# EAGLE design SmartServoModule_1_0 (EAGLE 9.6.2)
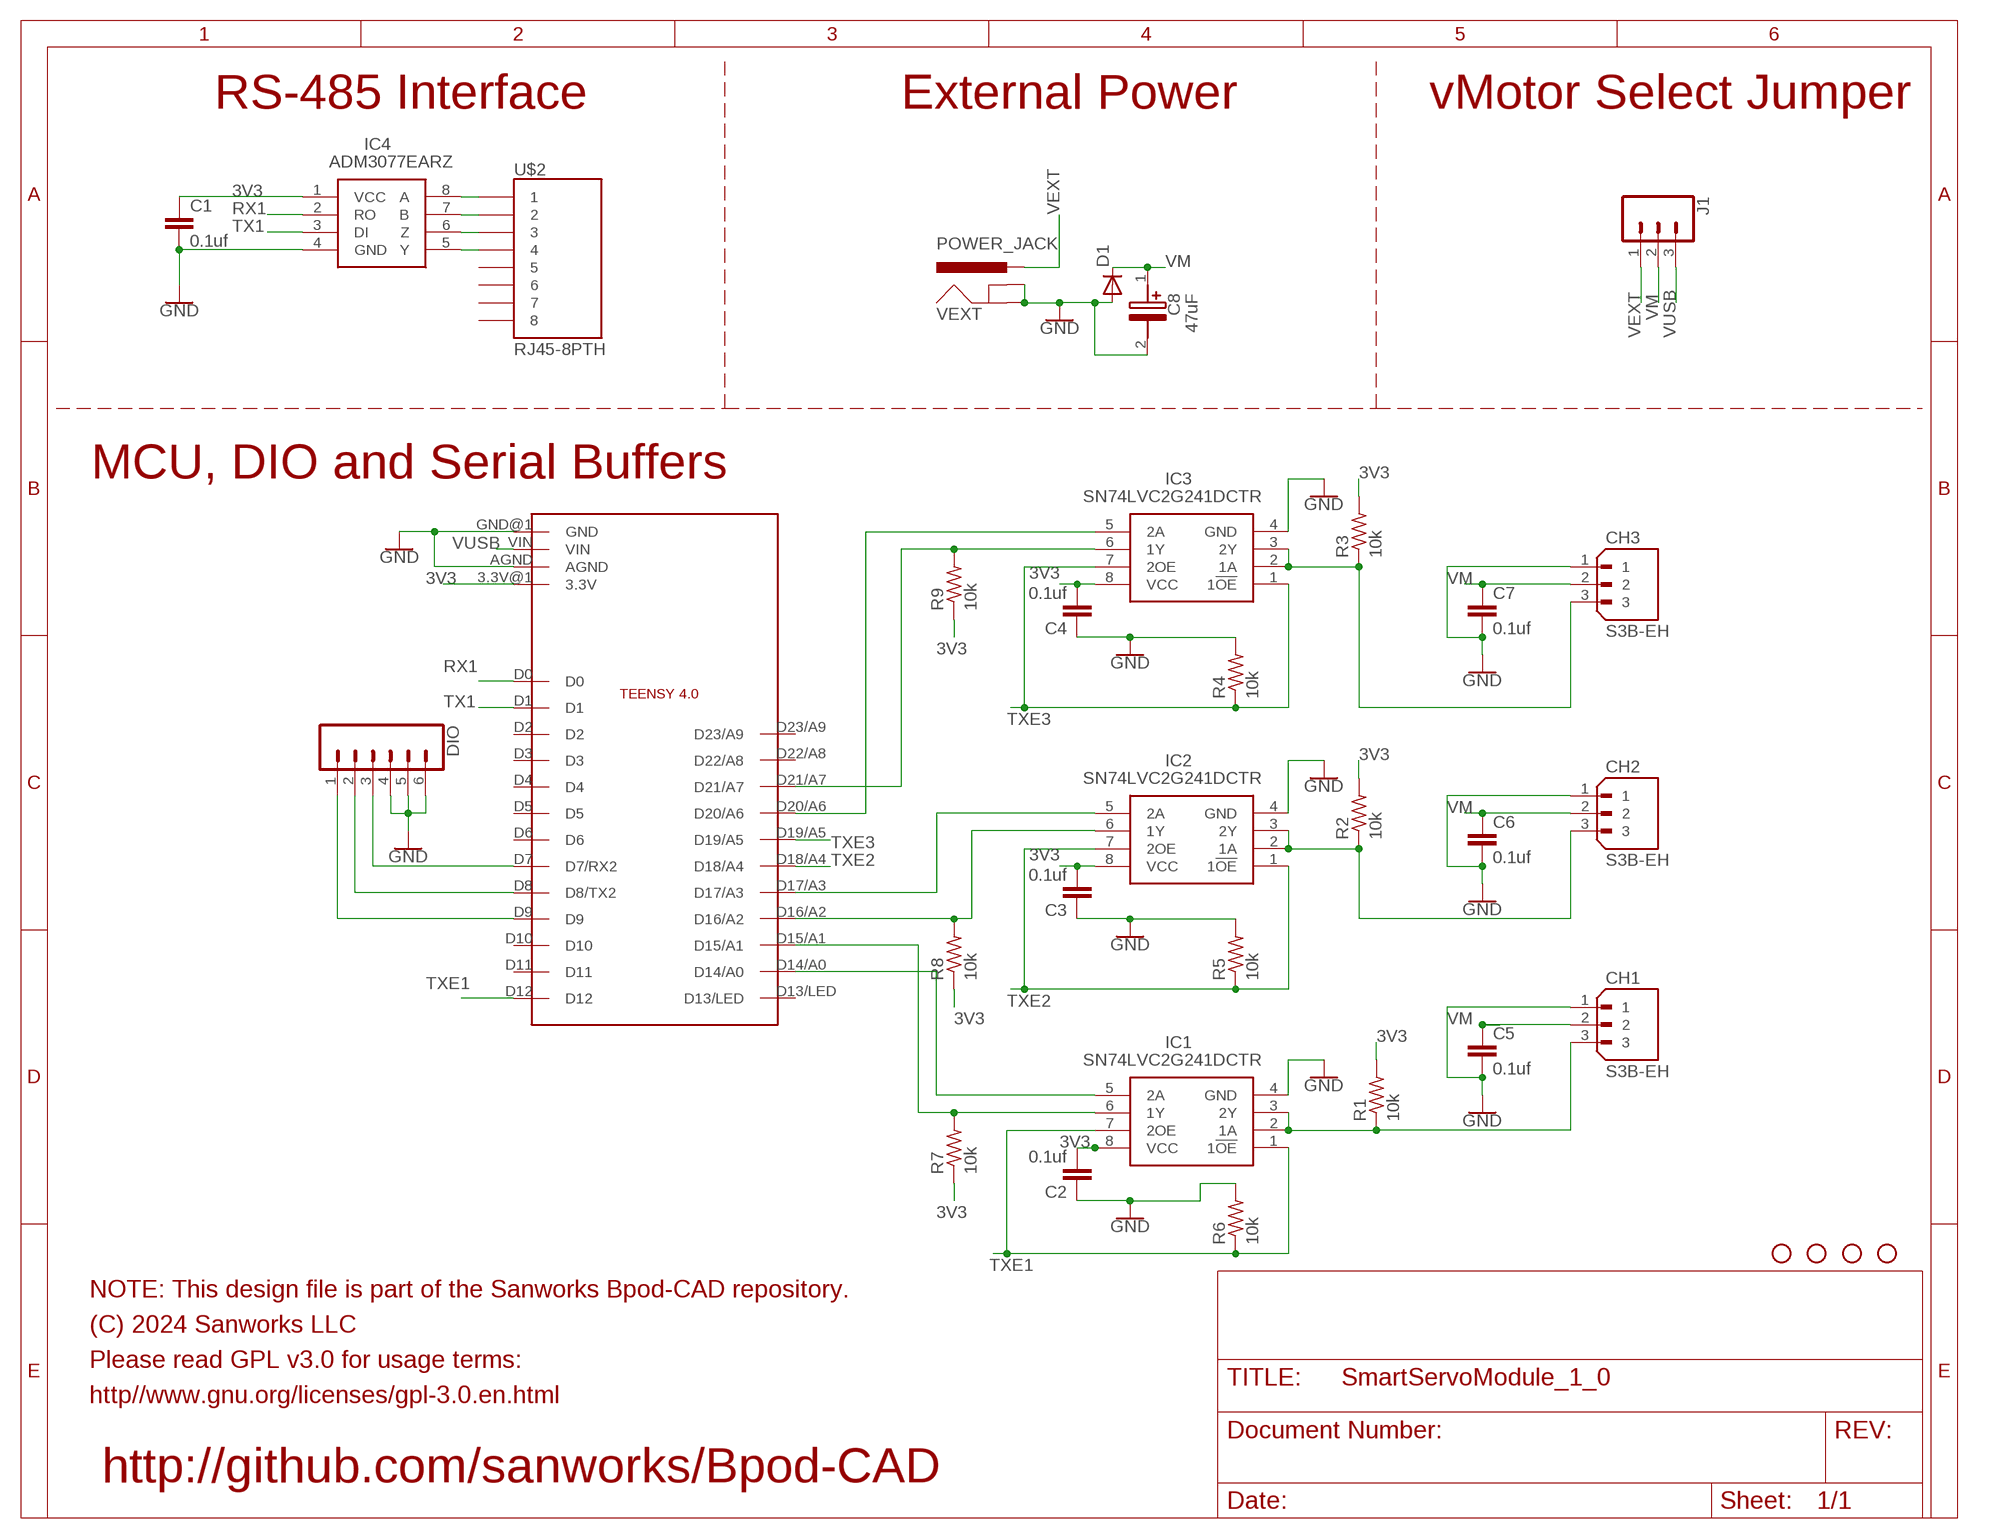
[diagram p0: schematic, sheet 1]

## Parts
C1  0.1uf  10UF-0805-10V-10%  [0805]
C2  0.1uf  10UF-0805-10V-10%  [0805]
C3  0.1uf  10UF-0805-10V-10%  [0805]
C4  0.1uf  10UF-0805-10V-10%  [0805]
C5  0.1uf  10UF-0805-10V-10%  [0805]
C6  0.1uf  10UF-0805-10V-10%  [0805]
C7  0.1uf  10UF-0805-10V-10%  [0805]
C8  47uF  EEH-ZA1V470P  [EEHZA1E101XP]
CH1  S3B-EH  [JST_S3B-EH]
CH2  S3B-EH  [JST_S3B-EH]
CH3  S3B-EH  [JST_S3B-EH]
D1  DIODE-DO214AA  [DO214AA]
DIO  CONN_063.5MM-6  [SCREWTERMINAL-3.5MM-6]
H1  STAND-OFF  [STAND-OFF]
H2  STAND-OFF  [STAND-OFF]
H3  STAND-OFF  [STAND-OFF]
H4  STAND-OFF  [STAND-OFF]
IC1  SN74LVC2G241DCTR  [SOP65P400X130-8N]
IC2  SN74LVC2G241DCTR  [SOP65P400X130-8N]
IC3  SN74LVC2G241DCTR  [SOP65P400X130-8N]
IC4  ADM3077EARZ  [SOIC127P600X175-8N]
J1  CONN_03LOCK  [1X03_LOCK]
MC1  TEENSY4.0_SIMPLE_NO_VUSB  [TEENSY4.0_SIMPLE_NO_VUSB]
R1  10k  R-US_R0805  [R0805]
R2  10k  R-US_R0805  [R0805]
R3  10k  R-US_R0805  [R0805]
R4  10k  R-US_R0805  [R0805]
R5  10k  R-US_R0805  [R0805]
R6  10k  R-US_R0805  [R0805]
R7  10k  R-US_R0805  [R0805]
R8  10k  R-US_R0805  [R0805]
R9  10k  R-US_R0805  [R0805]
U$2  RJ45-8PTH  [RJ45-8]
VEXT  POWER_JACK  [POWER_JACK_PTH]

## Nets
3V3: C1.1 C2.2 C3.2 C4.2 IC1.8(VCC) IC2.8(VCC) IC3.8(VCC) IC4.1(VCC) MC1.3.3V@1(3.3V) R1.2 R2.2 R3.2 R7.1 R8.1 R9.1
GND: C1.2 C2.1 C3.1 C4.1 C5.2 C6.2 C7.2 C8.2(-) CH1.1 CH2.1 CH3.1 D1.A DIO.4 DIO.5 DIO.6 IC1.4(GND) IC2.4(GND) IC3.4(GND) IC4.4(GND) MC1.AGND MC1.GND@1(GND) R4.2 R5.2 R6.2 VEXT.GND VEXT.GNDBREAK
N$1: IC4.6(Z) U$2.3
N$2: CH1.3 IC1.2(1A) IC1.3(2Y) R1.1
N$3: IC4.8(A) U$2.1
N$4: IC4.5(Y) U$2.4
N$5: IC4.7(B) U$2.2
N$6: CH2.3 IC2.2(1A) IC2.3(2Y) R2.1
N$7: CH3.3 IC3.2(1A) IC3.3(2Y) R3.1
N$8: DIO.1 MC1.D9
N$9: DIO.2 MC1.D8(D8/TX2)
N$10: DIO.3 MC1.D7(D7/RX2)
N$11: IC1.5(2A) MC1.D14/A0
N$12: IC1.6(1Y) MC1.D15/A1 R7.2
N$13: IC2.5(2A) MC1.D17/A3
N$14: IC2.6(1Y) MC1.D16/A2 R8.2
N$15: IC3.5(2A) MC1.D20/A6
N$16: IC3.6(1Y) MC1.D21/A7 R9.2
RX1: IC4.2(RO) MC1.D0
TX1: IC4.3(DI) MC1.D1
TXE1: IC1.1(1!OE) IC1.7(2OE) MC1.D12 R6.1
TXE2: IC2.1(1!OE) IC2.7(2OE) MC1.D18/A4 R5.1
TXE3: IC3.1(1!OE) IC3.7(2OE) MC1.D19/A5 R4.1
VEXT: J1.1 VEXT.PWR
VM: C5.1 C6.1 C7.1 C8.1(+) CH1.2 CH2.2 CH3.2 D1.C J1.2
VUSB: J1.3 MC1.VIN
Unconnected: MC1.D2 MC1.D3 MC1.D4 MC1.D5 MC1.D6 MC1.D10 MC1.D11 MC1.D13/LED MC1.D22/A8 MC1.D23/A9 U$2.5 U$2.6 U$2.7 U$2.8

## Notes on the sheet
- RS-485 Interface | External Power | vMotor Select Jumper
- MCU, DIO and Serial Buffers
- NOTE: This design file is part of the Sanworks Bpod-CAD repository.
- (C) 2024 Sanworks LLC
- Please read GPL v3.0 for usage terms:
- http//www.gnu.org/licenses/gpl-3.0.en.html
- http://github.com/sanworks/Bpod-CAD

## Library data of the parts
C1-C7 = SparkFun-Capacitors:10UF: 10.0µF ceramic capacitors A capacitor is a passive two-terminal electrical component used to store electrical energy temporarily in an electric field.; PROD_ID: CAP-11330; VALUE: 10uF
C8 = EEH-ZA1V470P:EEH-ZA1V470P: Aluminum Organic Polymer Capacitors 47uF 35volt AEC-Q200 Source: Datasheet <http://industrial.panasonic.com/cdbs/www-data/pdf/RDD0000/ABA0000C1221.pdf>; DESCRIPTION: Aluminum Organic Polymer Capacitors 47uF 35volt AEC-Q200; HEIGHT: 8.3mm; MANUFACTURER_NAME: Panasonic; MANUFACTURER_PART_NUMBER: EEH-ZA1V470P; MOUSER_PART_NUMBER: 667-EEH-ZA1V470P; MOUSER_PRICE-STOCK: https://www.mouser.co.uk/ProductDetail/Panasonic/EEH-ZA1V470P?qs=7UCyOFMWVHbDVjI675WvgQ%3D%3D
CH1-CH3 = S3B-EH:S3B-EH; MANUFACTURER: JST Sales; MAXIMUM_PACKAGE_HEIGHT: 4.2mm; PARTREV: 16/3/22; STANDARD: Manufacturer Recommendations
D1 = diode:DIODE-: DIODE
DIO = SparkFun-Connectors:CONN_06: Multi connection point. Often used as Generic Header-pin footprint for 0.1 inch spaced/style header connections On any of the 0.1 inch spaced packages, you can populate with these: Break Away Headers - Straight <https://www.sparkfun.com/products/116> (PRT-00116) Break Away Male Headers - Right Angle <https://www.sparkfun.com/products/553> (PRT-00553) Female Headers <https://www.sparkfun.com/products/115> (PRT-00115) Break Away Headers - Machine Pin <https://www.sparkfun.com/products/117> (PRT-00117) Break Away Female Headers - Swiss Machine Pin <https://www.sparkfun.com/products/743> (PRT-00743) Arduino Stackable Header - 6 Pin <https://www.sparkfun.com/products/9280> (PRT-09280) For SCREWTERMINALS and SPRING TERMINALS visit here: Screw Terimnals on SparkFun.com <https://www.sparkfun.com/search/results?term=Screw+Terminals> (5mm/3.5mm/2.54mm spacing) This device is also useful as a general connection point to wire up your design to another part of your project. Our various solder wires solder well into these plated through hole pads. Hook-Up Wire - Assortment (Stranded, 22 AWG) <https://www.sparkfun.com/products/11375> (PRT-11375) Hook-Up Wire - Assortment (Solid Core, 22 AWG) <https://www.sparkfun.com/products/11367> (PRT-11367) View the entire wire category on our website here <https://www.sparkfun.com/categories/141>
H1-H4 = SparkFun-Hardware:STAND-OFF: Stand Off Drill holes for mechanically mounting via screws, standoffs, etc. Note: Use the keepout ring to avoid running the screw head into surrounding components. Variant Overviews STAND-OFF - Mechanical footprint for a #4 phillips button head screw. STAND-OFF-TIGHT - Mechanical footprint for a #4 phillips button head screw, Example SparkFun Products Screw - Phillips Head (1/4", 4-40, 10 pack) <https://www.sparkfun.com/products/10453> (PRT-10453) Screw - Phillips Head (1/2", 4-40, 10 pack) <https://www.sparkfun.com/products/10452> (PRT-10452) Screw - Phillips Head (3/4", 4-40, 10 pack) <https://www.sparkfun.com/products/10451> (PRT-10451) Screw - Phillips Head (1", 4-40, 10 pack) <https://www.sparkfun.com/products/10450> (PRT-10450)
IC1-IC3 = SN74LVC2G241DCTR:SN74LVC2G241DCTR: Dual Buffer/Driver With 3-State Outputs Source: Datasheet <http://www.ti.com/lit/gpn/sn74lvc2g241>; DESCRIPTION: Dual Buffer/Driver With 3-State Outputs; HEIGHT: 1.3mm; MANUFACTURER_NAME: Texas Instruments; MANUFACTURER_PART_NUMBER: SN74LVC2G241DCTR; MOUSER_PART_NUMBER: 595-SN74LVC2G241DCTR; MOUSER_PRICE-STOCK: https://www.mouser.co.uk/ProductDetail/Texas-Instruments/SN74LVC2G241DCTR?qs=FetendrIl6uh8lISnOsUbw%3D%3D
IC4 = ADM3077EARZ:ADM3077EARZ: ADM3077EARZ, Line Transceiver 16Mbit/s Differential, 3.3 V, 8-Pin SOIC Source: Datasheet <http://www.analog.com/static/imported-files/data_sheets/ADM3070E_3071E_3072E_3073E_3074E_3075E_3076E_3077E_3078E.pdf>; DESCRIPTION: ADM3077EARZ, Line Transceiver 16Mbit/s Differential, 3.3 V, 8-Pin SOIC; HEIGHT: 1.75mm; MANUFACTURER_NAME: Analog Devices; MANUFACTURER_PART_NUMBER: ADM3077EARZ; MOUSER_PART_NUMBER: 584-ADM3077EARZ; MOUSER_PRICE-STOCK: https://www.mouser.co.uk/ProductDetail/Analog-Devices/ADM3077EARZ?qs=BpaRKvA4VqHlrE32Vsw1mw%3D%3D
J1 = SparkFun-Connectors:CONN_03: Multi connection point. Often used as Generic Header-pin footprint for 0.1 inch spaced/style header connections On any of the 0.1 inch spaced packages, you can populate with these: Break Away Headers - Straight <https://www.sparkfun.com/products/116> (PRT-00116) Break Away Male Headers - Right Angle <https://www.sparkfun.com/products/553> (PRT-00553) Female Headers <https://www.sparkfun.com/products/115> (PRT-00115) Break Away Headers - Machine Pin <https://www.sparkfun.com/products/117> (PRT-00117) Break Away Female Headers - Swiss Machine Pin <https://www.sparkfun.com/products/743> (PRT-00743) Stackable Header - 3 Pin (Female, 0.1") <https://www.sparkfun.com/products/13875> (PRT-13875) For SCREWTERMINALS and SPRING TERMINALS visit here: Screw Terimnals on SparkFun.com <https://www.sparkfun.com/search/results?term=Screw+Terminals> (5mm/3.5mm/2.54mm spacing) This device is also useful as a general connection point to wire up your design to another part of your project. Our various solder wires solder well into these plated through hole pads. Hook-Up Wire - Assortment (Stranded, 22 AWG) <https://www.sparkfun.com/products/11375> (PRT-11375) Hook-Up Wire - Assortment (Solid Core, 22 AWG) <https://www.sparkfun.com/products/11367> (PRT-11367) View the entire wire category on our website here <https://www.sparkfun.com/categories/141> Special notes: Molex polarized connector foot print use with SKU : PRT-08232 with associated crimp pins and housings.
MC1 = Teensy4.0_SIMPLE_N_VUSB:TEENSY4.0_SIMPLE_NO_VUSB: Tennsy 4.0 simple layout (no underside pins or VUSB )
R1-R9 = adafruit:R-US_: RESISTOR, American symbol
U$2 = SparkFun:RJ45-8: RJ45 Jack Simple RJ45, 8-pin connection - connector for common Cat5, Cat5e, and Cat6 Ethernet cables. Footprint not yet proven in production. Connector sku is PRT-00643; Breakout PCB sku is BOB-00716.
VEXT = SparkFun-Connectors:POWER_JACK: Power Jack Connector This is the standard 5.5mm barrel jack for power. The PTH is the most common, proven, reliable, footprint. The Slot footprint only works if the mill layer is transmitted to the PCB fab house so be warned. Here are the connectors we sell at SparkFun: DC Barrel Power Jack/Connector <https://www.sparkfun.com/products/119> (PRT-00119) DC Barrel Power Jack/Connector (SMD) <https://www.sparkfun.com/products/12748> (PRT-12748) DC Barrel Jack Adapter - Breadboard Compatible <https://www.sparkfun.com/products/10811> (PRT-10811) It is used on this SparkFun product (and many, many others): SparkFun RedBoard - Programmed with Arduino <https://www.sparkfun.com/products/12757> (DEV-12757) Also, if you need a mating power supply or connector, please check these out: Wall Adapter Power Supply - 9VDC 650mA <https://www.sparkfun.com/products/298> (TOL-00298) DC Barrel Jack Adapter - Male <https://www.sparkfun.com/products/10287> (PRT-10287); PROD_ID: CONN-08197

## Board
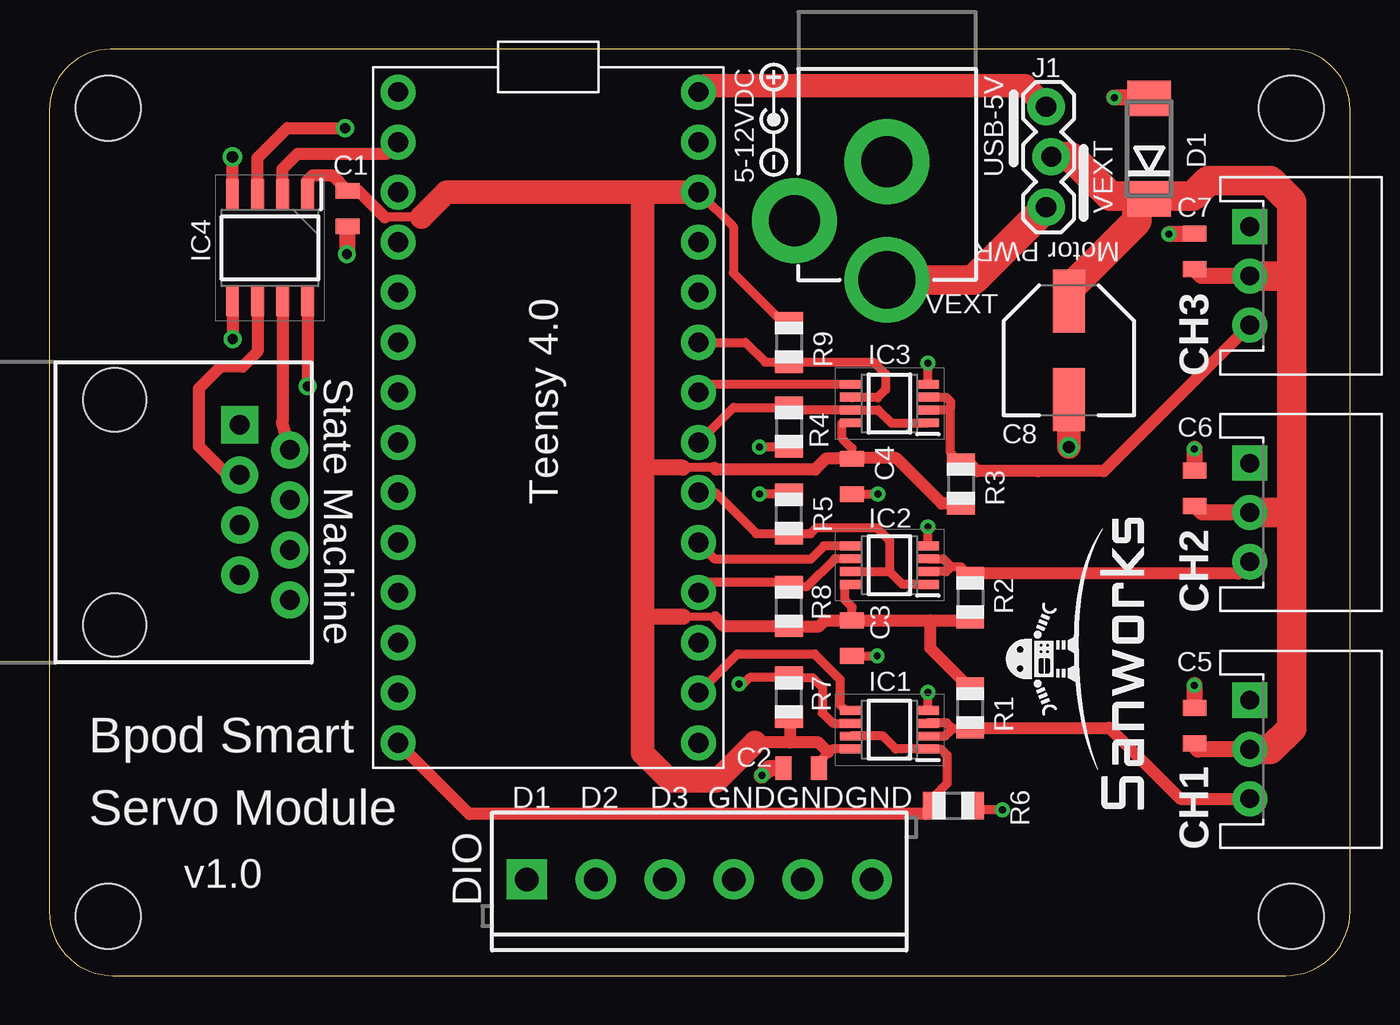
[diagram p1: board, top side]
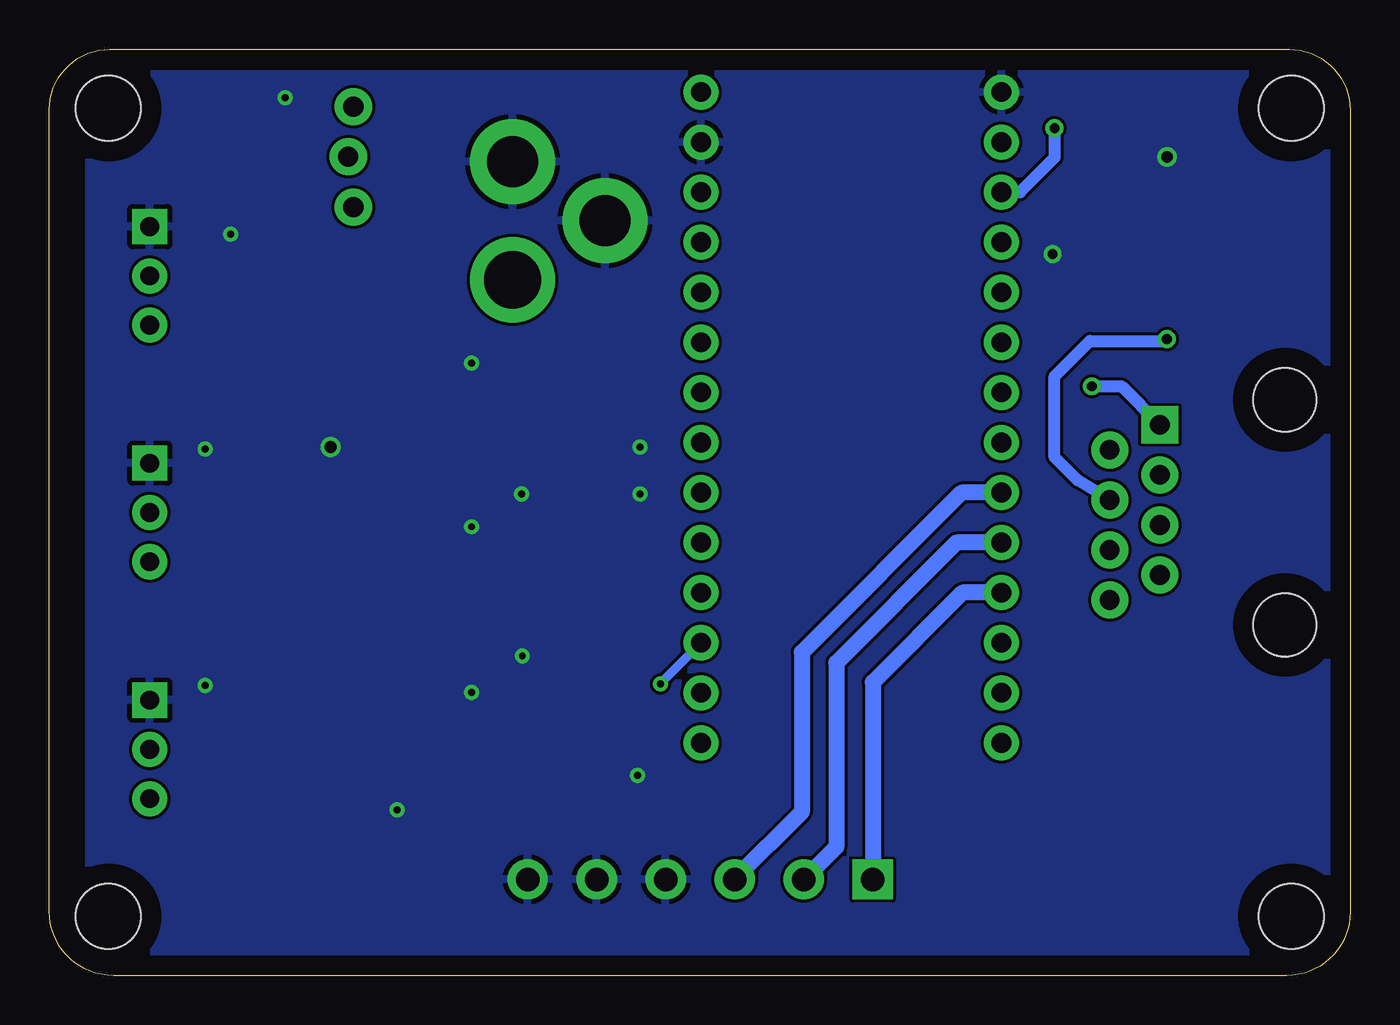
[diagram p2: board, bottom side, seen from below]

Size 66 x 47 mm. Coordinates in mm from the lower left corner, seen from the top.
Outline: 3.22,0 62.74,0 arc90 66,3.26 66,43.94 arc90 62.94,47 3.1,47 arc90 0,43.91 0,3.22 arc90 3.22,0
Copper layers (1*16): Top 0.035mm / dielectric 1.5mm / Bottom 0.035mm
Design rules "default": minimum track width 6mil, minimum drill 0.35mm, track to track 6mil, track to pad 6mil, pad to pad 6mil, via to via 6mil, smd to smd 6mil, copper to edge 40mil, drill to drill 6mil, minimum pad ring 10mil, minimum via ring 8mil, stop-mask expansion 4mil, vias tented up to drill 0mil, thermal gap 10mil

### Footprints (pad centres in the part's own frame; a part is rotated, then mirrored left to right if it is on the bottom)
0805 = smd 0.8 x 1.2: 1 -0.9,0; 2 0.9,0
EEHZA1E101XP = smd 3.2 x 1.6: 1 -2.5,0; 2 2.5,0
JST_S3B-EH = drill 0.95 pad 1.778 square: 1 2.5,2.6 | drill 0.95 pad 1.778: 2 0,2.6; 3 -2.5,2.6
DO214AA = smd 1.8 x 2.2: A 2.55,0; C -2.55,0
SCREWTERMINAL-3.5MM-6 = drill 1.2 pad 2.032 square: 1 0,0 | drill 1.2 pad 2.032: 2 3.5,0; 3 7,0; 4 10.5,0; 5 14,0; 6 17.5,0
STAND-OFF = hole 3.302: 0,0
SOP65P400X130-8N = smd 1.1 x 0.45: 1 -1.95,0.975; 2 -1.95,0.325; 3 -1.95,-0.325; 4 -1.95,-0.975; 5 1.95,-0.975; 6 1.95,-0.325; 7 1.95,0.325; 8 1.95,0.975
SOIC127P600X175-8N = smd 1.525 x 0.65: 1 -2.712,1.905; 2 -2.712,0.635; 3 -2.712,-0.635; 4 -2.712,-1.905; 5 2.712,-1.905; 6 2.712,-0.635; 7 2.712,0.635; 8 2.712,1.905
1X03_LOCK = drill 1.016 pad 1.88: 1 0,0.127; 2 2.54,-0.127; 3 5.08,0.127
TEENSY4.0_SIMPLE_NO_VUSB = drill 1 pad 1.778: 3.3V@1 7.62,10.16; AGND 7.62,12.7; D0 -7.62,12.7; D1 -7.62,10.16; D2 -7.62,7.62; D3 -7.62,5.08; D4 -7.62,2.54; D5 -7.62,0; D6 -7.62,-2.54; D7 -7.62,-5.08; D8 -7.62,-7.62; D9 -7.62,-10.16; D10 -7.62,-12.7; D11 -7.62,-15.24; D12 -7.62,-17.78; D13/LED 7.62,-17.78; D14/A0 7.62,-15.24; D15/A1 7.62,-12.7; D16/A2 7.62,-10.16; D17/A3 7.62,-7.62; D18/A4 7.62,-5.08; D19/A5 7.62,-2.54; D20/A6 7.62,0; D21/A7 7.62,2.54; D22/A8 7.62,5.08; D23/A9 7.62,7.62; GND@1 -7.62,15.24; VIN 7.62,15.24
R0805 = smd 1.1 x 1.4: 1 -1,0; 2 1,0
RJ45-8 = drill 1 pad 1.88 square: 1 -4.445,6.35 | drill 1 pad 1.88: 2 -3.175,8.89; 3 -1.905,6.35; 4 -0.635,8.89; 5 0.635,6.35; 6 1.905,8.89; 7 3.175,6.35; 8 4.445,8.89 | hole 3.2: -5.715,0; 5.715,0
POWER_JACK_PTH = drill 2.6 pad 4.318: GND 0,7.7; GNDBREAK 4.7,10.7 | drill 2.9 pad 4.318: PWR 0,13.7

### Placement (x,y rotation side)
C1  15.14,38.91 270 top
C2  38.15,10.53 0 top
C3  40.73,17.12 90 top
C4  40.73,25.32 90 top
C5  58.1,12.68 90 top
C6  58.1,24.73 90 top
C7  58.1,36.75 90 top
C8  51.73,31.73 270 top
CH1  63.5,11.47 90 top
CH2  63.5,23.5 90 top
CH3  63.5,35.5 90 top
D1  55.8,41.95 90 top
DIO  24.23,4.88 0 top
H1  63,44 0 top
H2  63,3 0 top
H3  3,3 0 top
H4  3,44 0 top
IC1  42.62,12.47 180 top
IC2  42.62,20.82 180 top
IC3  42.62,29.02 180 top
IC4  11.2,36.92 270 top
J1  50.7,39 90 top
MC1  25.32,29.59 0 top
R1  46.73,13.57 90 top
R2  46.73,19.18 270 top
R3  46.25,24.95 270 top
R4  37.52,27.82 270 top
R5  37.52,23.43 90 top
R6  45.88,8.62 0 top
R7  37.52,14.12 90 top
R8  37.52,18.73 90 top
R9  37.52,32.12 270 top
U$1  [SANWORKS_LOGO_SM]  55.65,8.28 90 top
U$2  3.31,23.5 270 top
U$3  [POS-CTR-SYMBOL]  37.48,40.55 90 top
VEXT  42.5,49 180 top

### Tracks (layer width: path | path; a pad name or v marks a point on that pad's centre or on a via)
3V3
  Top 0.4: 33.77,18.19 32.19,18.19 32.17,18.2
  Top 0.45: 18.88,38.48 17.02,38.48 | MC1.3.3V@1 34.7,37.99 34.7,35.65 37.23,33.12 R9.1 | C3.2 40.73,18.7 40.35,19.07 40.35,19.85 IC2.8 | 33.73,25.77 33.72,25.78 32.15,25.78 | C4.2 40.73,26.75 40.23,27.25 40.23,28.05 IC3.8 | C2.2 39.05,10.85 39.52,11.32 39.7,11.5 IC1.8
  Top 0.6: 17.02,38.48 15.69,39.81 C1.1 14.35,40.6 13.35,40.6 13.11,40.35 IC4.1 | 33.77,18.19 34.24,17.73 R8.1 39.05,17.73 39.35,18.02 C3.2 44.7,18.02 | 44.7,18.02 46.58,18.02 | R1.2 44.7,16.6 44.7,18.02 | 33.73,25.77 33.83,25.68 38.85,25.68 39.4,26.23 C4.2 40.75,26.25 42.98,26.25 45.27,23.95 R3.2 | 39.52,11.32 39.02,11.82 37.58,11.82 | 37.58,11.82 35.8,11.82 | 37.58,13.07 37.58,11.82
  Top 0.8: 32.17,18.2 30.1,18.2 | 46.58,18.02 R2.2 | 32.15,25.78 30.15,25.78 30.1,25.73 | R7.1 37.58,13.07
  Top 1.2: MC1.3.3V@1 30.1,39.75 | 30.1,39.75 20.15,39.75 18.88,38.48 | 30.1,39.75 30.1,25.73 30.1,18.2 30.1,11.3 31.52,9.88 33.85,9.88 35.8,11.82
GND  (via drill 0.35, 0.5, 0.6)
  Top 0.45: IC3.4 v44.58,31.07 | IC2.4 v44.58,22.77 | IC1.4 v44.58,14.38 | C4.1 v42.05,24.43 | C3.1 v42,16.23 | v48.35,8.4 47.1,8.4 R6.2 | R4.2 v36.02,26.82 | R5.2 v36.02,24.43
  Top 0.6: C1.2 15.1,37.97 | IC4.4 v9.29,41.53 v9.29,41.54
  Top 0.8: 15.1,37.97 v15.1,36.6 | D1.A 55.92,44.55 v54.02,44.55 | C7.2 58.08,37.62 v56.8,37.62 | v58.1,26.73 C6.2 | v58.1,14.72 C5.2 | C2.1 36.52,10.53 v36.15,10.15
  Top 1.2: C8.2 v51.73,26.82
  pour Bottom: 1,46 64,46 64,1 1,1
N$1
  Top 0.6: U$2.3 9.04,25.41 7.6,26.85 7.6,29.8 8.7,30.9 9.8,30.9 10.56,31.66 IC4.6
N$2
  Top 0.45: IC1.2 45.45,12.15 45.73,12.43 45.73,12.53 | 45.73,12.53 45.73,12.62 45.52,12.82 44.6,12.82 IC1.3 | R1.1 46.77,12.53 45.73,12.53
  Top 0.6: R1.1 53.77,12.57 57.38,8.97 CH1.3
N$3  (via drill 0.5)
  Top 0.6: v13.1,29.9 v13.1,29.91 13.11,29.91 IC4.8
  Bottom 0.6: U$2.1 11.62,29.9 v13.1,29.9
N$4  (via drill 0.5)
  Top 0.6: 9.29,32.31 v9.3,32.3 v9.29,32.3 IC4.5
  Bottom 0.6: U$2.4 13.84,25.14 15,26.3 15,30.4 13.2,32.2 9.3,32.2 v9.3,32.3
N$5
  Top 0.6: U$2.2 11.8,28.07 11.84,28.11 IC4.7
N$6
  Top 0.45: IC2.3 45.35,21.15 45.62,20.88 45.62,20.73 | 45.62,20.73 45.62,20.62 45.5,20.5 IC2.2 | R2.1 46.27,20.73 45.62,20.73
  Top 0.6: R2.1 46.95,20.4 60.3,20.4 CH2.3
N$7
  Top 0.45: IC3.3 45.5,29.35 45.73,29.12 45.73,28.82 | IC3.2 45.6,28.7 45.73,28.82 | R3.1 45.73,26.53 45.73,28.82
  Top 0.6: R3.1 46.73,25.95 47.08,25.6 50.16,25.6 53.5,25.6 CH3.3
N$8
  Bottom 0.8: MC1.D9 19.67,19.43 24.23,14.88 DIO.1
N$9
  Bottom 0.8: MC1.D8 19.98,21.97 26.07,15.88 26.07,6.53 DIO.2
N$10
  Bottom 0.8: MC1.D7 19.71,24.51 27.82,16.4 27.82,8.3 31.23,4.9 DIO.3
N$11
  Top 0.45: MC1.D14/A0 34.91,16.32 38.83,16.32 40.12,15.03 40.12,13.72 40.4,13.45 IC1.5
N$12  (via drill 0.35)
  Top 0.45: v35,14.8 35.2,14.8 35.52,15.12 R7.2 38.73,15.12 39.23,14.62 39.23,13.32 39.75,12.8 IC1.6
  Bottom 0.45: v35,14.8 35,14.83 MC1.D15/A1
N$13
  Top 0.45: IC2.5 39.3,21.8 38.62,21.12 33.78,21.12 MC1.D17/A3
N$14
  Top 0.45: MC1.D16/A2 33.47,19.95 37.3,19.95 R8.2 38.42,19.73 39.85,21.15 IC2.6
N$15
  Top 0.45: MC1.D20/A6 33.35,30 IC3.5
N$16
  Top 0.45: MC1.D21/A7 35.32,32.13 36.33,31.12 R9.2 41.83,31.12 42.42,30.52 42.42,29.73 42.02,29.32 40.7,29.32 IC3.6
RX1
  Top 0.6: MC1.D0 17.11,41.7 12.6,41.7 11.82,40.92 IC4.2
TX1  (via drill 0.5)
  Top 0.6: v15,43 12.07,43 10.55,41.48 IC4.3
  Bottom 0.6: v15,43 15,41.5 16.75,39.75 MC1.D1
TXE1
  Top 0.45: IC1.7 42.3,12.15 42.95,11.5 IC1.1 45.23,11.5 45.55,11.18 45.55,9.75 44.88,9.07 R6.1
  Top 0.6: MC1.D12 21.31,8.2 44.45,8.2 R6.1
TXE2
  Top 0.45: MC1.D18/A4 33.79,24.51 35.88,22.43 R5.1 38.62,22.43 38.92,22.73 41.98,22.73 42.62,22.07 42.62,20.5 | IC2.7 42.62,20.5 | IC2.1 43.27,19.85 42.62,20.5
TXE3
  Top 0.45: MC1.D19/A5 34.72,28.82 R4.1 37.65,28.7 IC3.7 42.05,28.7 42.73,28.02 44.55,28.02 IC3.1
VEXT
  Top 1.5: VEXT.PWR 46.87,35.3 J1.1
VM
  Top 0.8: CH3.2 58.45,35.5 C7.1 | CH2.2 58.48,23.5 C6.1 | CH1.2 58.27,11.47 C5.1
  Top 1.2: D1.C 56.05,39.4
  Top 1.5: J1.2 51.84,41.54 53.83,39.55 55.17,39.55 55.17,39.38 | 55.17,39.38 55.77,39.38 D1.C 55.95,39.55 58.02,39.55 58.8,40.33 61.95,40.33 63.02,39.25 63.02,35.17 | 63.02,35.17 63.02,23.82 | CH3.2 62.7,35.5 63.02,35.17 | C8.1 51.73,34.83 55.17,38.27 55.17,39.38 | CH2.2 62.7,23.5 63.02,23.82 | CH1.2 61.95,11.47 63.02,12.55 63.02,23.82
VUSB
  Top 1.2: MC1.VIN 33.27,45.16 49.5,45.16 J1.3

### Text on the board
tPlace: USB-5V | 5-12VDC | VEXT | Motor PWR | State Machine | Teensy 4.0 | Bpod Smart | Servo Module | D1 | D2 | D3 | GND | GND | GND | v1.0